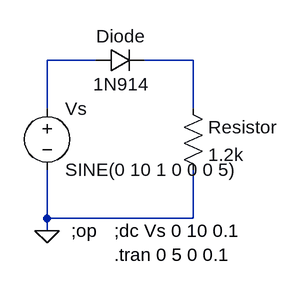
[diagram p0: schematic H1 - dari materi.asc]
H1 - dari materi.asc, the LTspice schematic file:
Version 4
SHEET 1 880 680
WIRE -192 -192 -256 -192
WIRE -64 -192 -128 -192
WIRE -256 -128 -256 -192
WIRE -64 -128 -64 -192
WIRE -256 16 -256 -48
WIRE -64 16 -64 -48
WIRE -64 16 -256 16
WIRE -256 32 -256 16
FLAG -256 32 0
SYMBOL voltage -256 -144 R0
WINDOW 123 0 0 Left 0
WINDOW 39 0 0 Left 0
SYMATTR InstName Vs
SYMATTR Value SINE(0 10 1 0 0 0 5)
SYMBOL res -80 -144 R0
SYMATTR InstName Resistor
SYMATTR Value 1.2k
SYMBOL diode -192 -176 R270
WINDOW 0 32 32 VTop 2
WINDOW 3 0 32 VBottom 2
SYMATTR InstName Diode
SYMATTR Value 1N914
TEXT -224 32 Left 2 !;op
TEXT -168 64 Left 2 !.tran 0 5 0 0.1
TEXT -168 32 Left 2 !;dc Vs 0 10 0.1

The netlist it stands for:
* H1 - dari materi.asc
Vs N001 0 SINE(0 10 1 0 0 0 5)
Resistor N002 0 1.2k
Diode N001 N002 1N914
.model D D
.lib standard.dio
;op
.tran 0 5 0 0.1
;dc Vs 0 10 0.1
.backanno
.end